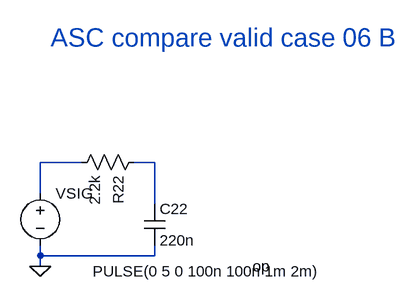
[diagram p0: schematic valid_case_06_b.asc]
valid_case_06_b.asc, the LTspice schematic file:
Version 4.1
SHEET 1 880 680
WIRE 128 96 64 96
WIRE 240 96 208 96
WIRE 64 144 64 96
WIRE 240 160 240 96
WIRE 64 240 64 224
WIRE 240 240 240 224
WIRE 240 240 64 240
WIRE 64 256 64 240
FLAG 64 256 0
SYMBOL res 224 80 R90
SYMATTR InstName R22
SYMATTR Value 2.2k
SYMBOL cap 224 160 R0
SYMATTR InstName C22
SYMATTR Value 220n
SYMBOL voltage 64 128 R0
WINDOW 123 0 0 Left 2
WINDOW 39 0 0 Left 2
WINDOW 3 81 136 Left 2
SYMATTR InstName VSIG
SYMATTR Value PULSE(0 5 0 100n 100n 1m 2m)
TEXT 384 256 Left 2 !.op
TEXT 80 -96 Left 4 ;ASC compare valid case 06 B

The netlist it stands for:
* valid_case_06_b.asc
R22 N002 N001 2.2k
C22 N002 0 220n
VSIG N001 0 PULSE(0 5 0 100n 100n 1m 2m)
.op
* ASC compare valid case 06 B
.backanno
.end